# Altium schematic sheet controlador.SchDoc
size A4
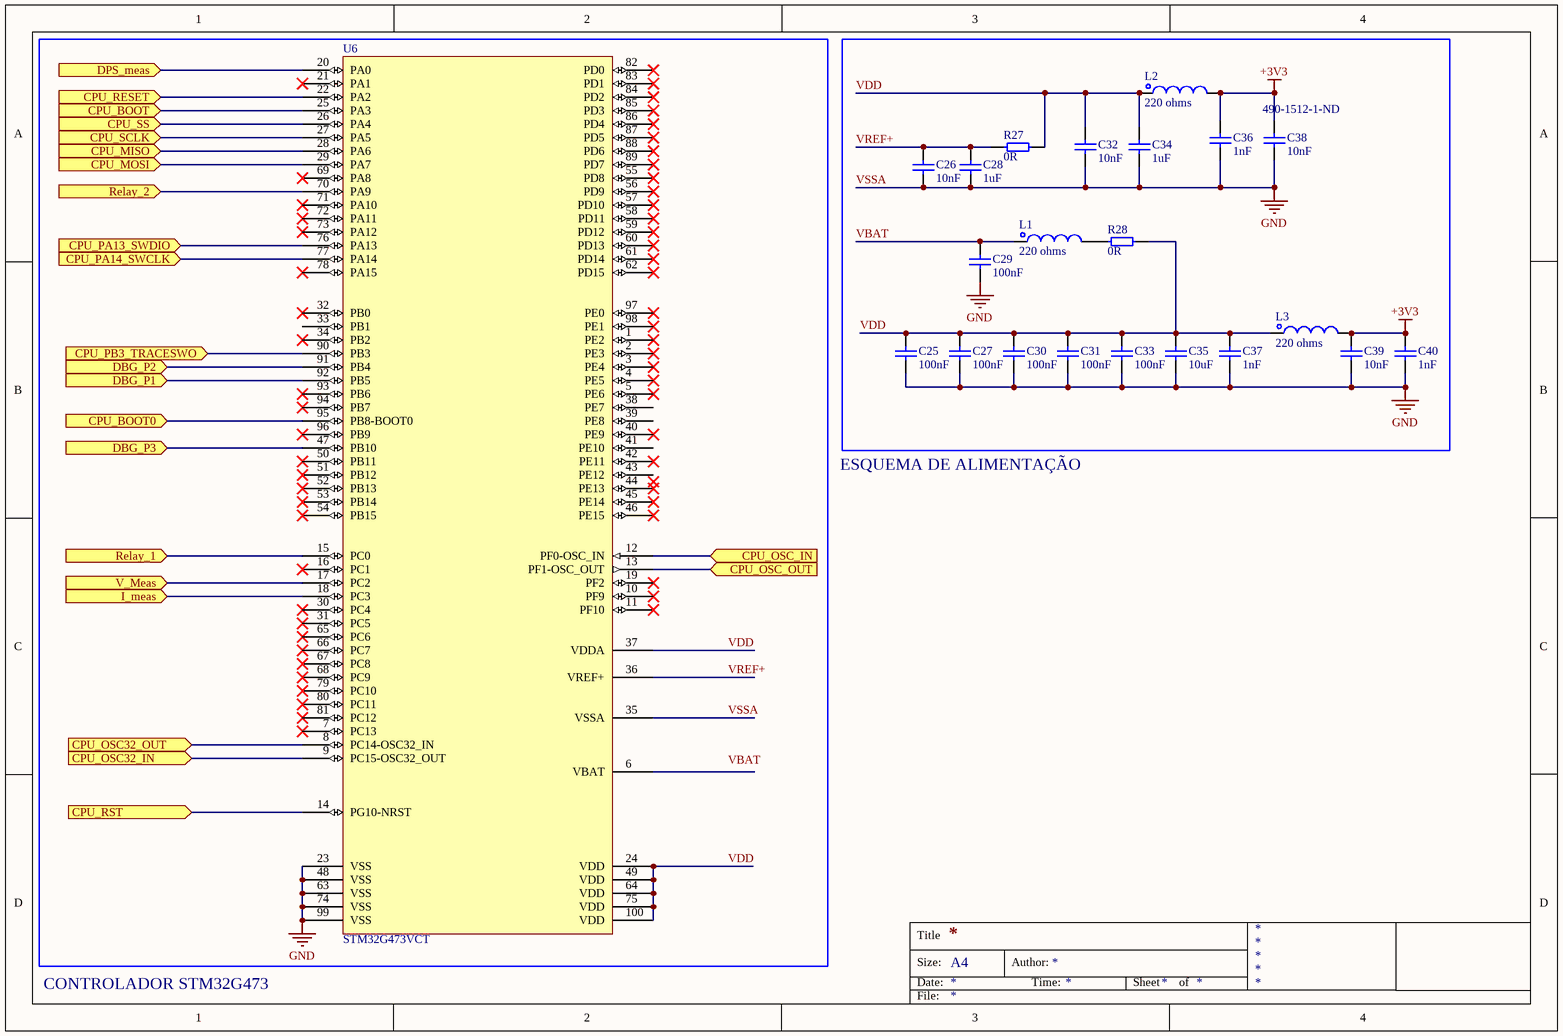
[diagram p0: controlador.SchDoc]

## Parts
C25  100nF  [0603]
C26  10nF  [0603]
C27  100nF  [0603]
C28  1uF  [0603]
C29  100nF  [0603]
C30  100nF  [0603]
C31  100nF  [0603]
C32  10nF  [0603]
C33  100nF  [0603]
C34  1uF  [0603]
C35  10uF  [0603]
C36  1nF  [0603]
C37  1nF  [0603]
C38  10nF  Supplier Part Number 1: 490-1512-1-ND  [0603]
C39  10nF  [0603]
C40  1nF  [0603]
L1  220 ohms  [0603]
L2  220 ohms  [0603]
L3  220 ohms  [0603]
R27  0R  [0603]
R28  0R  [0603]
U6  STM32G473VCT  [LQFP100_14MMX14MM]

## Ports
CPU_BOOT0 (in), CPU_BOOT (in), CPU_MISO (in), CPU_MOSI (in), CPU_OSC32_IN (in), CPU_OSC32_OUT (in), CPU_OSC_IN (in), CPU_OSC_OUT (in), CPU_PA13_SWDIO (in), CPU_PA14_SWCLK (in), CPU_PB3_TRACESWO (in), CPU_RESET (in), CPU_RST (in), CPU_SCLK (in), CPU_SS (in), DBG_P1 (in), DBG_P2 (in), DBG_P3 (in), DPS_meas (in), I_meas (in), Relay_1 (in), Relay_2 (in), V_Meas (in)

## Nets
+3V3: C36.2 C38.2 C39.2 C40.2 L2.2 L3.2
VSSA: C25.2 C26.1 C27.2 C28.1 C29.2 C30.2 C31.2 C32.1 C33.2 C34.1 C35.1 C36.1 C37.1 C38.1 C39.1 C40.1 U6.23(VSS) U6.35(VSSA) U6.48(VSS) U6.63(VSS) U6.74(VSS) U6.99(VSS)  [also labelled GND]
CPU_BOOT: U6.25(PA3) ; port CPU_BOOT
CPU_BOOT0: U6.95(PB8-BOOT0) ; port CPU_BOOT0
CPU_MISO: U6.28(PA6) ; port CPU_MISO
CPU_MOSI: U6.29(PA7) ; port CPU_MOSI
CPU_OSC32_IN: U6.9(PC15-OSC32_OUT) ; port CPU_OSC32_IN
CPU_OSC32_OUT: U6.8(PC14-OSC32_IN) ; port CPU_OSC32_OUT
CPU_OSC_IN: U6.12(PF0-OSC_IN) ; port CPU_OSC_IN
CPU_OSC_OUT: U6.13(PF1-OSC_OUT) ; port CPU_OSC_OUT
CPU_PA13_SWDIO: U6.76(PA13) ; port CPU_PA13_SWDIO
CPU_PA14_SWCLK: U6.77(PA14) ; port CPU_PA14_SWCLK
CPU_PB3_TRACESWO: U6.90(PB3) ; port CPU_PB3_TRACESWO
CPU_RESET: U6.22(PA2) ; port CPU_RESET
CPU_RST: U6.14(PG10-NRST) ; port CPU_RST
CPU_SCLK: U6.27(PA5) ; port CPU_SCLK
CPU_SS: U6.26(PA4) ; port CPU_SS
DBG_P1: U6.92(PB5) ; port DBG_P1
DBG_P2: U6.91(PB4) ; port DBG_P2
DBG_P3: U6.47(PB10) ; port DBG_P3
DPS_meas: U6.20(PA0) ; port DPS_meas
I_meas: U6.18(PC3) ; port I_meas
Relay_1: U6.15(PC0) ; port Relay_1
Relay_2: U6.70(PA9) ; port Relay_2
V_Meas: U6.17(PC2) ; port V_Meas
VBAT: C29.1 L1.1
VDD: C25.1 C27.1 C30.1 C31.1 C32.2 C33.1 C34.2 C35.2 C37.2 L2.1 L3.1 R27.1 R28.2 U6.24(VDD) U6.37(VDDA) U6.49(VDD) U6.64(VDD) U6.75(VDD) U6.100(VDD)
VREF+: C26.2 C28.2 R27.2 U6.36(VREF+)
NetL1_2: L1.2 R28.1

Not connected (* = marked no-connect by the designer): U6 1(PE2)* 2(PE3)* 3(PE4)* 4(PE5)* 5(PE6)* 6(VBAT) 7(PC13)* 10(PF9)* 11(PF10)* 16(PC1)* 19(PF2)* 21(PA1)* 30(PC4)* 31(PC5)* 32(PB0)* 33(PB1) 34(PB2)* 38(PE7) 39(PE8) 40(PE9)* 41(PE10) 42(PE11)* 43(PE12) 44(PE13)* 45(PE14)* 46(PE15)* 50(PB11)* 51(PB12)* 52(PB13)* 53(PB14)* 54(PB15)* 55(PD8)* 56(PD9)* 57(PD10)* 58(PD11)* 59(PD12)* 60(PD13)* 61(PD14)* 62(PD15)* 65(PC6)* 66(PC7)* 67(PC8)* 68(PC9)* 69(PA8)* 71(PA10)* 72(PA11)* 73(PA12)* 78(PA15)* 79(PC10)* 80(PC11)* 81(PC12)* 82(PD0)* 83(PD1)* 84(PD2)* 85(PD3)* 86(PD4)* 87(PD5)* 88(PD6)* 89(PD7)* 93(PB6)* 94(PB7)* 96(PB9)* 97(PE0)* 98(PE1)*

## Notes on the sheet
- ESQUEMA DE ALIMENTAÇÃO
- CONTROLADOR STM32G473
- Labels drawn without touching a wire or pin: VBAT
- Title
- Size:
- Date:
- A4
- Author:
- Time:
- Sheet
- of
- File:

## Library data of the parts
C25 C27 C29-C31 C33 = CAP CER SMD-0603 100nF - 50V: Capacitor Ceramic 100nF 20% 50V 0603 (1608 Metric) X7R; MPN: C0603C104M5RACTU; Manufacturer: KEMET; CDI: 018177; Op_Temperature: -55 C to +125 C; Type: Capacitor Ceramic; Value: 100nF; Tolerance: 20%; Package: Tape & Reel; RoHS: SIM; Voltage: 50V; Case: 0603 (1608 Metric); Temp_Coefficient: X7R; NCM: *; CDI_Alternate: *; MPN_Alternate: *; Manufacturer_Alternate: *; Price (und.): 0,10000; Price (10k): 0.00741; Supplier 1: RSComponents; Supplier Part Number 1: 6698842
C26 C32 C38 C39 = CAP CER SMD-0603 10nF - 50V: Capacitor Ceramic 10nF 10% 50V 0603 (1608 Metric) X7R; MPN: 06035C103KAT4A; Manufacturer: AVX; CDI: 017932; Op_Temperature: -55 C to +125 C; Type: Capacitor Ceramic; Value: 10nF; Tolerance: 10%; Package: Tape & Reel; RoHS: SIM; Voltage: 50V; Case: 0603 (1608 Metric); Temp_Coefficient: X7R; NCM: *; CDI_Alternate: *; MPN_Alternate: *; Manufacturer_Alternate: *; Price (und.): 0,10000; Price (10k): 0.00621
  C26 C39: Supplier 1: Digi-Key; Supplier Part Number 1: 490-1512-1-ND
  C38: Supplier 1: Digi-Key
C28 C34 = CAP CER SMD-0603 1uF - 16V: Capacitor Ceramic 1uF 10% 16V 0603 (1608 Metric) X7R; MPN: 0603YC105KAT2A; Manufacturer: AVX; CDI: 018282; Op_Temperature: -55 C to +125 C; Type: Capacitor Ceramic; Value: 1uF; Tolerance: 10%; Package: Tape & Reel; RoHS: SIM; Voltage: 16V; Case: 0603 (1608 Metric); Temp_Coefficient: X7R; NCM: *; CDI_Alternate: *; MPN_Alternate: *; Manufacturer_Alternate: *; Price (und.): 0,21000; Price (10k): 0.03795; Supplier 1: Digi-Key; Supplier Part Number 1: 490-3897-1-ND
  C34: Supplier 2: Digi-Key; Supplier Part Number 2: 490-1512-1-ND
C35 = CAP CER SMD-0603 10uF - 10V: Capacitor Ceramic 10µF 10% 10V 0603 (1608 Metric) X7R; MPN: C3216X7R1C106K160AC; Manufacturer: TDK; MPN_Alternate: C0603C106M8PAC7411; CDI: 017467; Op_Temperature: -55 C to +125 C; Type: Capacitor Ceramic; Value: 10uF; Voltage: 10V; Tolerance: 10%; Package: Tape & Reel; Case: 0603 (1608 Metric); Temp_Coefficient: X7R; RoHS: SIM; NCM: *; CDI_Alternate: *; Manufacturer_Alternate: *; Price (und.): 0.33; Price (10k): 0.07; Supplier 1: Newark; Supplier Part Number 1: 03AC2652
C36 C37 C40 = CAP CER SMD-0603 1nF - 50V: Capacitor Ceramic 1nF 5% 50V 0603 (1608 Metric) C0G (NP0); MPN: GRM1885C1H102JA01D; Manufacturer: Murata; MPN_Alternate: CGA3E2C0G1H102J080AE; CDI: 017469; Op_Temperature: -55 C to +125 C; Type: Capacitor Ceramic; Value: 1nF; Tolerance: 5%; Package: Tape & Reel; RoHS: SIM; Voltage: 50V; Case: 0603 (1608 Metric); Temp_Coefficient: C0G (NP0); NCM: *; CDI_Alternate: *; Manufacturer_Alternate: *; Price (und.): 0,10000; Price (10k): 0.01032; Supplier 1: RSComponents; Supplier Part Number 1: 1356303
L1-L3 = INDUTOR BEAD - 2.2A - 50 OHMS 100 MHZ: INDUTOR BEAD - 2.2A - 220 OHMS 100 MHZ; MPN: BLM18KG221SZ1D; Manufacturer: Murata; Type: Ferrite Bead; Tolerance: 25%; Frequency: 100 MHz; Op_Temperature: -55°C ~ 125°C; CDI: 014249; Value: 220 ohms; Package: Tape & Reel; RoHS: SIM; Case: 0603; Current: 2.2 A; Price (10k): 0.02146; Price (und.): 0,10000; Supplier 1: Newark; Supplier Part Number 1: 73M9123
R27 R28 = RES SMD-0603 0R 1% 1/10W: Resistor Thick Film 0R Jumper 0.1W, 1/10W 0603 (1608 metric) Jumper; MPN: CRCW06030000Z0EA; Manufacturer: Vishay; CDI: 017334; Op_Temperature: -55 C to +155 C; Type: Resistor Thick Film; Value: 0R; Tolerance: Jumper; Package: Tape & Reel; RoHS: SIM; Power (Watts): 1/10W; Case: 0603; Price (10k): 0.00318; Price (und.): 0,10000
U6 = STM32G473VCT: Manufacturer: ST - Microlectronics; Op_Temperature: -40°C ~ 85°C; CDI: 020680; Value: STM32G473VCT; MPN: STM32G473VCT; Case: LQFP-100; Package: Tray; Price (10k): 4.78; Price (und.): 8.87; RoHS: SIM; Type: ARM Microcontrollers - MCU; Supplier 1: Newark; Supplier Part Number 1: 39AH3584